# Altium schematic sheet General.SchDoc
size A4; SheetNumber: 1; SheetTotal: 3
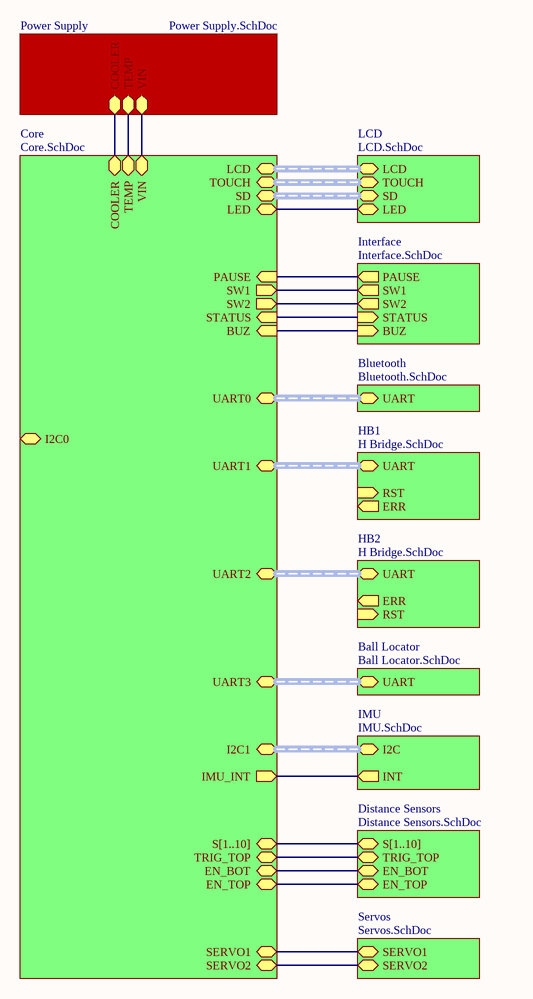
[diagram p0: General.SchDoc]

## Sub-sheets
Ball Locator = Ball Locator.SchDoc: UART (harness UART)
Bluetooth = Bluetooth.SchDoc: UART (harness UART)
Core = Core.SchDoc: VIN, LCD (harness LCD_BUS), TOUCH (harness TOUCH_BUS), PAUSE (in), UART3 (harness UART), UART1 (harness UART), UART2 (harness UART), I2C0 (harness I2C), I2C1 (harness I2C), UART0 (harness UART), STATUS (in), SW1 (out), SW2 (out), LED, SD (harness SD), IMU_INT (out), S[1..10], EN_BOT, EN_TOP, SERVO1, SERVO2, TEMP, COOLER, TRIG_TOP, BUZ (in)
Distance Sensors = Distance Sensors.SchDoc: S[1..10], EN_BOT, EN_TOP, TRIG_TOP
HB1 = H Bridge.SchDoc: RST (in), ERR (out), UART (harness UART)
HB2 = H Bridge.SchDoc: RST (in), ERR (out), UART (harness UART)
IMU = IMU.SchDoc: INT (out), I2C (harness I2C)
Interface = Interface.SchDoc: PAUSE (out), SW1 (out), SW2 (out), STATUS (in), BUZ (in)
LCD = LCD.SchDoc: LCD (harness LCD_BUS), TOUCH (harness TOUCH_BUS), LED, SD (harness SD)
Power Supply = Power Supply.SchDoc: VIN, TEMP, COOLER
Servos = Servos.SchDoc: SERVO1, SERVO2

## Nets
(unnamed): sheet Core/VIN, sheet Power Supply/VIN
(unnamed): sheet Core/PAUSE, sheet Interface/PAUSE
(unnamed): sheet Core/STATUS, sheet Interface/STATUS
(unnamed): sheet Core/SW1, sheet Interface/SW1
(unnamed): sheet Core/SW2, sheet Interface/SW2
(unnamed): sheet Core/LED, sheet LCD/LED
(unnamed): sheet Core/IMU_INT, sheet IMU/INT
(unnamed): sheet Core/EN_BOT, sheet Distance Sensors/EN_BOT
(unnamed): sheet Core/EN_TOP, sheet Distance Sensors/EN_TOP
(unnamed): sheet Core/SERVO1, sheet Servos/SERVO1
(unnamed): sheet Core/SERVO2, sheet Servos/SERVO2
(unnamed): sheet Core/TEMP, sheet Power Supply/TEMP
(unnamed): sheet Core/COOLER, sheet Power Supply/COOLER
(unnamed): sheet Core/TRIG_TOP, sheet Distance Sensors/TRIG_TOP
(unnamed): sheet Core/BUZ, sheet Interface/BUZ

## Buses and harness runs
bus sheet Core/S[1..10] = sheet Distance Sensors/S[1..10]
harness sheet Ball Locator/UART = sheet Core/UART3
harness sheet Bluetooth/UART = sheet Core/UART0
harness sheet Core/I2C1 = sheet IMU/I2C
harness sheet Core/LCD = sheet LCD/LCD
harness sheet Core/SD = sheet LCD/SD
harness sheet Core/TOUCH = sheet LCD/TOUCH
harness sheet Core/UART1 = sheet HB1/UART
harness sheet Core/UART2 = sheet HB2/UART